# Altium schematic sheet Display.SchDoc
size A3
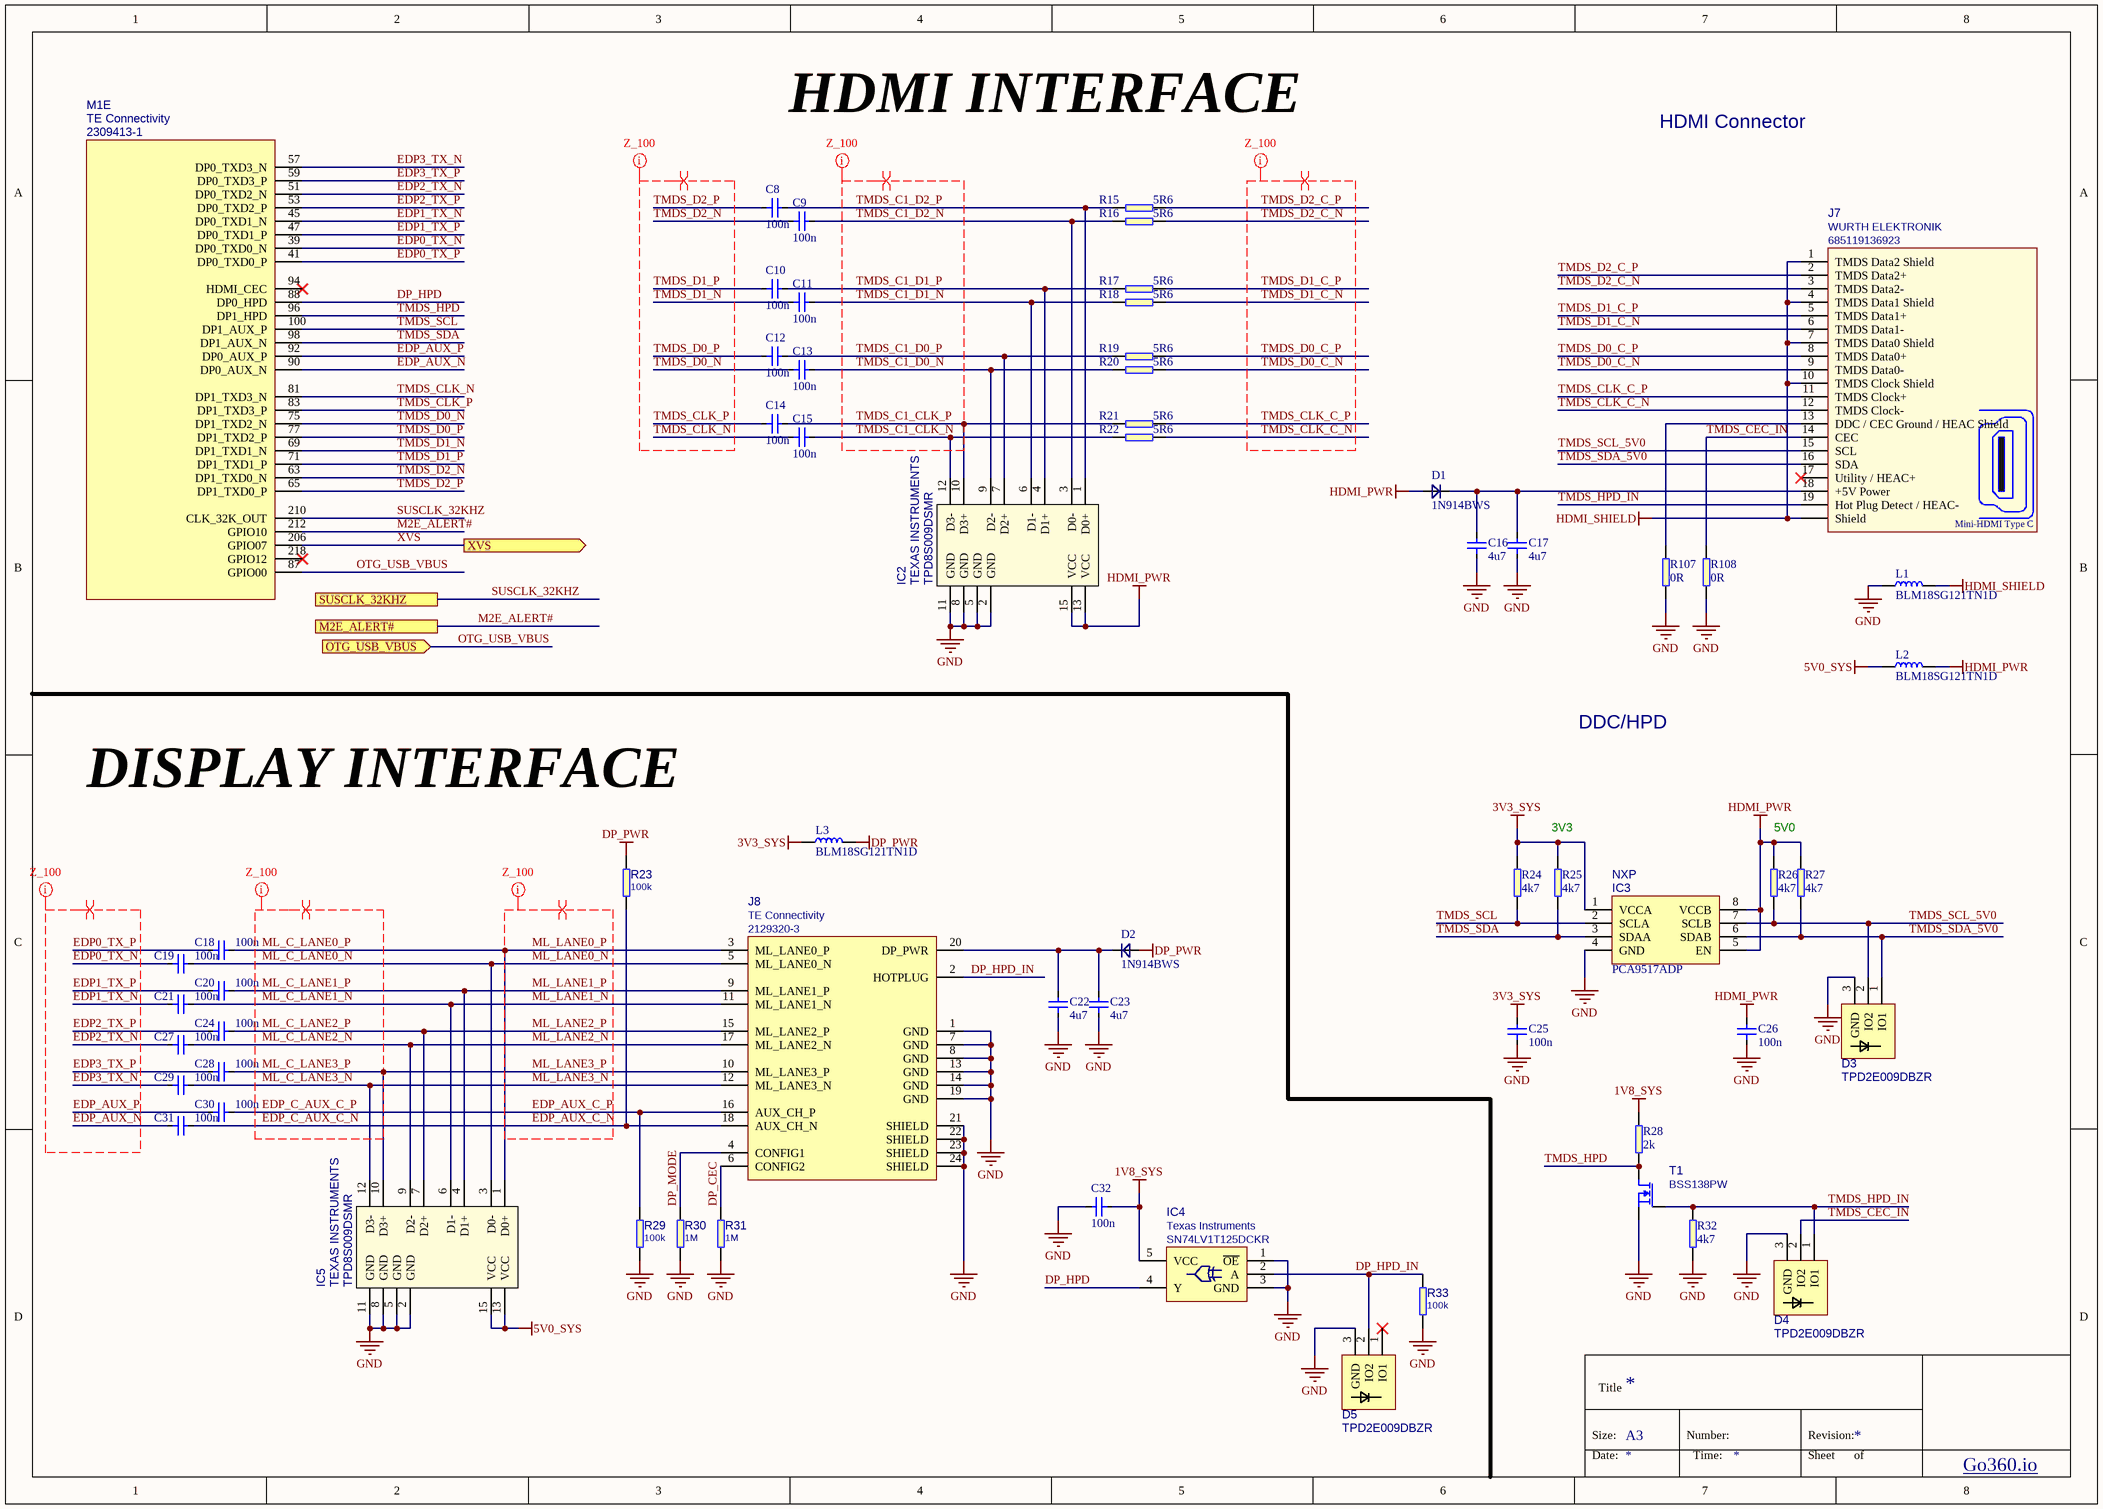
[diagram p0: Display.SchDoc]

## Parts
C8  100n  [C0402]
C9  100n  [C0402]
C10  100n  [C0402]
C11  100n  [C0402]
C12  100n  [C0402]
C13  100n  [C0402]
C14  100n  [C0402]
C15  100n  [C0402]
C16  4u7  [C0402]
C17  4u7  [C0402]
C18  100n  [C0402]
C19  100n  [C0402]
C20  100n  [C0402]
C21  100n  [C0402]
C22  4u7  [C0402]
C23  4u7  [C0402]
C24  100n  [C0402]
C25  100n  [C0402]
C26  100n  [C0402]
C27  100n  [C0402]
C28  100n  [C0402]
C29  100n  [C0402]
C30  100n  [C0402]
C31  100n  [C0402]
C32  100n  [C0402]
D1  1N914BWS  [SOD-323]
D2  1N914BWS  [SOD-323]
D3  TPD2E009DBZR  [SOT-23s]
D4  TPD2E009DBZR  [SOT-23s]
D5  TPD2E009DBZR  [SOT-23s]
IC2  Manufacturer: TEXAS INSTRUMENTS  PartSymbol: TPD8S009DSMR  [SON-15]  (hidden comment: TPD8S009)
IC3  PCA9517ADP  [MSOP-8]
IC4  SN74LV1T125DCKR  Manufacturer: Texas Instruments  [SC70-5]
IC5  Manufacturer: TEXAS INSTRUMENTS  PartSymbol: TPD8S009DSMR  [SON-15]  (hidden comment: TPD8S009)
J7  685119136923  Manufacturer: WURTH ELEKTRONIK  [WE_685119136923]
J8  2129320-3  Manufacturer: TE Connectivity  [2129320-3]
L1  BLM18SG121TN1D  [BEADC1608X65N]
L2  BLM18SG121TN1D  [BEADC1608X65N]
L3  BLM18SG121TN1D  [BEADC1608X65N]
M1  Manufacturer: TE Connectivity  [jetson-nano-connector]  (hidden comment: 2309413-1)  (part E of 7)
R15  5R6  [R0402]
R16  5R6  [R0402]
R17  5R6  [R0402]
R18  5R6  [R0402]
R19  5R6  [R0402]
R20  5R6  [R0402]
R21  5R6  [R0402]
R22  5R6  [R0402]
R23  100k  [R0402]
R24  4k7  [R0402]
R25  4k7  [R0402]
R26  4k7  [R0402]
R27  4k7  [R0402]
R28  2k  [R0402]
R29  100k  [R0402]
R30  1M  [R0402]
R31  1M  [R0402]
R32  4k7  [R0402]
R33  100k  [R0402]
R107  0R  [R0402]
R108  0R  [R0402]
T1  BSS138PW  [SC70-3]

## Ports
M2E_ALERT#, OTG_USB_VBUS (in), SUSCLK_32KHZ, XVS (out)

## Nets
1V8_SYS: C32.1 IC4.5(VCC) R28.2
3V3_SYS: C25.2 IC3.1(VCCA) L3.1 R24.2 R25.2
5V0_SYS: IC5.13(VCC) IC5.15(VCC) L2.1
DP_PWR: D2.A L3.2 R23.1
GND: C16.1 C17.1 C22.1 C23.1 C25.1 C26.1 C32.2 D3.3(GND) D4.3(GND) D5.3(GND) IC2.2(GND) IC2.5(GND) IC2.8(GND) IC2.11(GND) IC3.4(GND) IC4.1(~{OE}) IC4.3(GND) IC5.2(GND) IC5.5(GND) IC5.8(GND) IC5.11(GND) J8.1(GND) J8.7(GND) J8.8(GND) J8.13(GND) J8.14(GND) J8.19(GND) J8.21(SHIELD) J8.22(SHIELD) J8.23(SHIELD) J8.24(SHIELD) L1.1 R29.2 R30.2 R31.2 R32.1 R33.2 R107.1 R108.1 T1.2(S)
HDMI_PWR: C26.2 D1.A IC2.13(VCC) IC2.15(VCC) IC3.5(EN) IC3.8(VCCB) L2.2 R26.2 R27.2
HDMI_SHIELD: J7.1(TMDS_Data2_Shield) J7.4(TMDS_Data1_Shield) J7.7(TMDS_Data0_Shield) J7.10(TMDS_Clock_Shield) J7.Shell(Shield) L1.2
DP_CEC: J8.6(CONFIG2) R31.1
DP_HPD: IC4.4(Y) M1.88(DP0_HPD)
DP_HPD_IN: D5.2(IO2) IC4.2(A) J8.2(HOTPLUG) R33.1
DP_MODE: J8.4(CONFIG1) R30.1
EDP0_TX_N: C19.1 M1.39(DP0_TXD0_N)
EDP0_TX_P: C18.1 M1.41(DP0_TXD0_P)
EDP1_TX_N: C21.1 M1.45(DP0_TXD1_N)
EDP1_TX_P: C20.1 M1.47(DP0_TXD1_P)
EDP2_TX_N: C27.1 M1.51(DP0_TXD2_N)
EDP2_TX_P: C24.1 M1.53(DP0_TXD2_P)
EDP3_TX_N: C29.1 M1.57(DP0_TXD3_N)
EDP3_TX_P: C28.1 M1.59(DP0_TXD3_P)
EDP_AUX_C_N: C31.2 J8.18(AUX_CH_N) R23.2  [also labelled EDP_C_AUX_C_N]
EDP_AUX_C_P: C30.2 J8.16(AUX_CH_P) R29.1  [also labelled EDP_C_AUX_C_P]
EDP_AUX_N: C31.1 M1.90(DP0_AUX_N)
EDP_AUX_P: C30.1 M1.92(DP0_AUX_P)
M2E_ALERT#: M1.212(GPIO10) ; port M2E_ALERT#
ML_C_LANE0_N: C19.2 IC5.3(D0-) J8.5(ML_LANE0_N)  [also labelled ML_LANE0_N]
ML_C_LANE0_P: C18.2 IC5.1(D0+) J8.3(ML_LANE0_P)  [also labelled ML_LANE0_P]
ML_C_LANE1_N: C21.2 IC5.6(D1-) J8.11(ML_LANE1_N)  [also labelled ML_LANE1_N]
ML_C_LANE1_P: C20.2 IC5.4(D1+) J8.9(ML_LANE1_P)  [also labelled ML_LANE1_P]
ML_C_LANE2_N: C27.2 IC5.9(D2-) J8.17(ML_LANE2_N)  [also labelled ML_LANE2_N]
ML_C_LANE2_P: C24.2 IC5.7(D2+) J8.15(ML_LANE2_P)  [also labelled ML_LANE2_P]
ML_C_LANE3_N: C29.2 IC5.12(D3-) J8.12(ML_LANE3_N)  [also labelled ML_LANE3_N]
ML_C_LANE3_P: C28.2 IC5.10(D3+) J8.10(ML_LANE3_P)  [also labelled ML_LANE3_P]
OTG_USB_VBUS: M1.87(GPIO00) ; port OTG_USB_VBUS
SUSCLK_32KHZ: M1.210(CLK_32K_OUT) ; port SUSCLK_32KHZ
TMDS_C1_CLK_N: C15.2 IC2.12(D3-) R22.1
TMDS_C1_CLK_P: C14.2 IC2.10(D3+) R21.1
TMDS_C1_D0_N: C13.2 IC2.9(D2-) R20.1
TMDS_C1_D0_P: C12.2 IC2.7(D2+) R19.1
TMDS_C1_D1_N: C11.2 IC2.6(D1-) R18.1
TMDS_C1_D1_P: C10.2 IC2.4(D1+) R17.1
TMDS_C1_D2_N: C9.2 IC2.3(D0-) R16.1
TMDS_C1_D2_P: C8.2 IC2.1(D0+) R15.1
TMDS_CEC_IN: D4.2(IO2) J7.14(CEC) R108.2
TMDS_CLK_C_N: J7.12(TMDS_Clock-) R22.2
TMDS_CLK_C_P: J7.11(TMDS_Clock+) R21.2
TMDS_CLK_N: C15.1 M1.81(DP1_TXD3_N)
TMDS_CLK_P: C14.1 M1.83(DP1_TXD3_P)
TMDS_D0_C_N: J7.9(TMDS_Data0-) R20.2
TMDS_D0_C_P: J7.8(TMDS_Data0+) R19.2
TMDS_D0_N: C13.1 M1.75(DP1_TXD2_N)
TMDS_D0_P: C12.1 M1.77(DP1_TXD2_P)
TMDS_D1_C_N: J7.6(TMDS_Data1-) R18.2
TMDS_D1_C_P: J7.5(TMDS_Data1+) R17.2
TMDS_D1_N: C11.1 M1.69(DP1_TXD1_N)
TMDS_D1_P: C10.1 M1.71(DP1_TXD1_P)
TMDS_D2_C_N: J7.3(TMDS_Data2-) R16.2
TMDS_D2_C_P: J7.2(TMDS_Data2+) R15.2
TMDS_D2_N: C9.1 M1.63(DP1_TXD0_N)
TMDS_D2_P: C8.1 M1.65(DP1_TXD0_P)
TMDS_HPD: M1.96(DP1_HPD) R28.1 T1.3(D)
TMDS_HPD_IN: D4.1(IO1) J7.19(Hot_Plug_Detect_/_HEAC-) R32.2 T1.1(G)
TMDS_SCL: IC3.2(SCLA) M1.100(DP1_AUX_P) R24.1
TMDS_SCL_5V0: D3.2(IO2) IC3.7(SCLB) J7.15(SCL) R26.1
TMDS_SDA: IC3.3(SDAA) M1.98(DP1_AUX_N) R25.1
TMDS_SDA_5V0: D3.1(IO1) IC3.6(SDAB) J7.16(SDA) R27.1
XVS: M1.206(GPIO07) ; port XVS
NetC16_2: C16.2 C17.2 D1.C J7.18(+5V_Power)
NetC22_2: C22.2 C23.2 D2.C J8.20(DP_PWR)
NetJ7_13: J7.13(DDC_/_CEC_Ground_/_HEAC_Shield) R107.2

Not connected (* = marked no-connect by the designer): D5 1(IO1)*; J7 17(Utility_/_HEAC+)*; M1 94(HDMI_CEC)* 218(GPIO12)*

## Layout directives
differential pair: EDP0_TX_N, EDP0_TX_P, EDP1_TX_N, EDP1_TX_P, EDP2_TX_N, EDP2_TX_P, EDP3_TX_N, EDP3_TX_P, EDP_AUX_C_N, EDP_AUX_C_P, EDP_AUX_N, EDP_AUX_P, EDP_C_AUX_C_N, EDP_C_AUX_C_P, ML_C_LANE0_N, ML_C_LANE0_P, ML_C_LANE1_N, ML_C_LANE1_P, ML_C_LANE2_N, ML_C_LANE2_P, ML_C_LANE3_N, ML_C_LANE3_P, ML_LANE0_N, ML_LANE0_P, ML_LANE1_N, ML_LANE1_P, ML_LANE2_N, ML_LANE2_P, ML_LANE3_N, ML_LANE3_P, TMDS_C1_CLK_N, TMDS_C1_CLK_P, TMDS_C1_D0_N, TMDS_C1_D0_P, TMDS_C1_D1_N, TMDS_C1_D1_P, TMDS_C1_D2_N, TMDS_C1_D2_P, TMDS_CLK_C_N, TMDS_CLK_C_P, TMDS_CLK_N, TMDS_CLK_P, TMDS_D0_C_N, TMDS_D0_C_P, TMDS_D0_N, TMDS_D0_P, TMDS_D1_C_N, TMDS_D1_C_P, TMDS_D1_N, TMDS_D1_P, TMDS_D2_C_N, TMDS_D2_C_P, TMDS_D2_N, TMDS_D2_P
net class Z_100: EDP0_TX_N, EDP0_TX_P, EDP1_TX_N, EDP1_TX_P, EDP2_TX_N, EDP2_TX_P, EDP3_TX_N, EDP3_TX_P, EDP_AUX_C_N, EDP_AUX_C_P, EDP_AUX_N, EDP_AUX_P, EDP_C_AUX_C_N, EDP_C_AUX_C_P, ML_C_LANE0_N, ML_C_LANE0_P, ML_C_LANE1_N, ML_C_LANE1_P, ML_C_LANE2_N, ML_C_LANE2_P, ML_C_LANE3_N, ML_C_LANE3_P, ML_LANE0_N, ML_LANE0_P, ML_LANE1_N, ML_LANE1_P, ML_LANE2_N, ML_LANE2_P, ML_LANE3_N, ML_LANE3_P, TMDS_C1_CLK_N, TMDS_C1_CLK_P, TMDS_C1_D0_N, TMDS_C1_D0_P, TMDS_C1_D1_N, TMDS_C1_D1_P, TMDS_C1_D2_N, TMDS_C1_D2_P, TMDS_CLK_C_N, TMDS_CLK_C_P, TMDS_CLK_N, TMDS_CLK_P, TMDS_D0_C_N, TMDS_D0_C_P, TMDS_D0_N, TMDS_D0_P, TMDS_D1_C_N, TMDS_D1_C_P, TMDS_D1_N, TMDS_D1_P, TMDS_D2_C_N, TMDS_D2_C_P, TMDS_D2_N, TMDS_D2_P

## Notes on the sheet
- HDMI INTERFACE
- HDMI Connector
- DDC/HPD
- DISPLAY INTERFACE
- 3V3
- 5V0
- (near IC3) NXP
- Title
- Size:
- Date:
- A3
- Number:
- Time:
- Revision:
- Sheet
- of
- Go360.io
- (in symbol WE_685119136923) Mini-HDMI Type C

## Library data of the parts
C8-C15 C18-C21 C24-C32 = C_100n_0402: MLCC SMT Capacitor 100n 0402; Manufacturer: TDK; PartSymbol: C1005X5R0J104K050BA; PartNumber: C_100n_0402; Value: 100n
C16 C17 C22 C23 = C_4u7_0402: MLCC SMT Capacitor 4.7uF 0402; Manufacturer: MURATA; PartSymbol: GRM155R60G475ME; PartNumber: C_4u7_0402; Value: 4u7
D1 D2 = diode: Diode small signal; Manufacturer: ON SEMICONDUCTOR; Value: 1N914BWS; PartNumber: 1N914BWS; PartSymbol: 1N914BWS
D3-D5 = TPD2E009DBZR: DIODE, SCHOTTKY, 30V, 200MA, SOT-23; Manufacturer: NXP; PartNumber: TPD2E009DBZR; Value: TPD2E009DBZR; MPN: TPD2E009DBZR
IC2 IC5 = TPD8S009: 8-Channel ESD Protection for DisplayPort and HDMI; Value: TPD8S009; PartNumber: TPD8S009
IC3 = PCA9517ADP: IC REDRIVER I2C 1CH 8TSSOP; Manufacturer: NXP; Value: PCA9517ADP; PartNumber: PCA9517ADP; PartSymbol: PCA9517ADP
IC4 = SN74LV1T125: Buffer, 74LV1T125, 1.6 V to 5.5 V, SOT-23-5; PartNumber: SN74LV1T125DCKR; Value: SN74LV1T125DCKR; PartSymbol: SN74LV1T125DCKR
J7 = WE_685119136923: CONN HDMI FEMALE R/A 19POS 2.6MM; PartNumber: WE_685119136923; Value: 685119136923; PartSymbol: WE_685119136923
J8 = miniDP: Mini Displayport Reverse Offset; PartNumber: 2129320-3; Value: 2129320-3; PartSymbol: 2129320-3
L1-L3 = BLM18SG121TN1D: FERRITE BEAD, 0.025OHM, 3A, 0603; Manufacturer: MURATA; PartNumber: BLM18SG121TN1D; Value: BLM18SG121TN1D; PartSymbol: BLM18SG121TN1D
M1 = jetson-nano-new-release: PartNumber: 2309413-1; PartSymbol: 2309413-1; Value: 2309413-1
R15-R22 = R_5R6_0402: RES, 5R6, 0402; Manufacturer: Panasonic; PartSymbol: ERJ2GEJ5R6X; PartNumber: R_5R6_0402; Value: 5R6
R23 R29 R33 = R_100k_0402: SMT Resistor 100k 0402; Manufacturer: VISHAY; PartSymbol: CRCW0402100KFKEDHP; Tolerance: 1%; PartNumber: R_100k_0402; Value: 100k
R24-R27 R32 = R_4k7_0402: RES, 4k7, 0402; Manufacturer: Panasonic; PartSymbol: ERJ2GEJ472X; PartNumber: R_4k7_0402; Value: 4k7
R28 = R_2k_0402: RES, 2k, 0402; Manufacturer: VISHAY; PartSymbol: CRCW04022K00FKED; PartNumber: R_2k_0402; Value: 2k
R30 R31 = R_1M_0402: SMT Resistor 1M 0402; Manufacturer: VISHAY; PartSymbol: CRCW04021M00FKED; Tolerance: 1%; PartNumber: R_1M_0402; Value: 1M
R107 R108 = R_0R_0402: RES, 0R, 0402; Manufacturer: Panasonic; PartSymbol: ERJ2GE0R00X; PartNumber: R_0R_0402; Value: 0R
T1 = NMOS: MOSFET, N CH, 60V, 0.2A; Manufacturer: NXP; Value: BSS138PW; PartNumber: BSS138PW; PartSymbol: BSS138PW